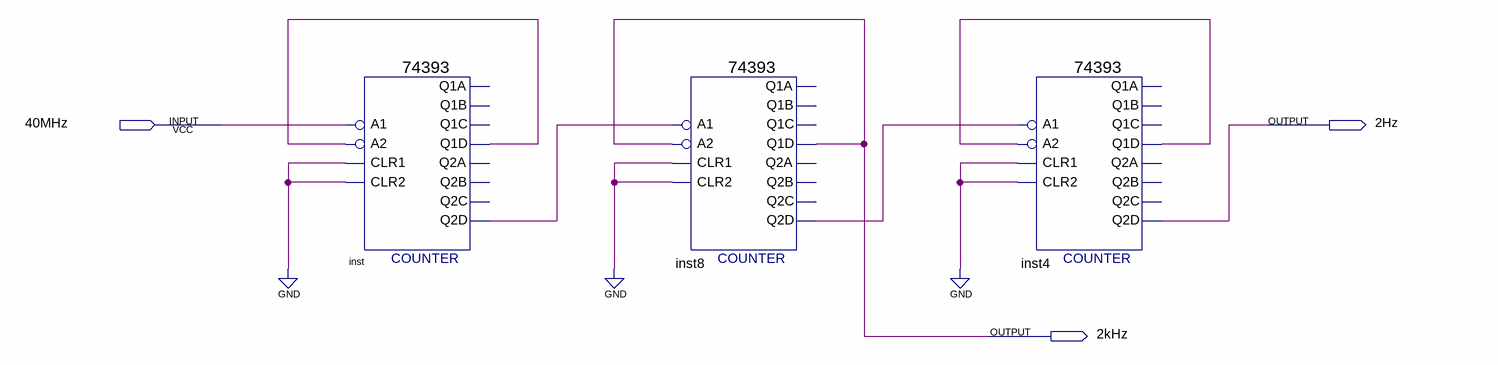
[diagram p0: schematic sheet]
// Quartus schematic 20M.bdf as structural Verilog: 3 symbols, 3 pins
module \20M  (
  input  \40MHz ,
  output \2Hz ,
  output \2kHz 
);

  wire inst4_q1d, inst8_q2d, inst_q1d, inst_q2d;

  \74393  inst (
    .A1(\40MHz ), .CLR1(1'b0), .A2(inst_q1d), .CLR2(1'b0), .Q2D(inst_q2d), .Q1D(inst_q1d));  // open: Q2C, Q2B, Q1C, Q2A, Q1A, Q1B
  \74393  inst8 (
    .A1(inst_q2d), .CLR1(1'b0), .A2(\2kHz ), .CLR2(1'b0), .Q2D(inst8_q2d), .Q1D(\2kHz ));  // open: Q2C, Q2B, Q1C, Q2A, Q1A, Q1B
  \74393  inst4 (
    .A1(inst8_q2d), .CLR1(1'b0), .A2(inst4_q1d), .CLR2(1'b0), .Q2D(\2Hz ), .Q1D(inst4_q1d));  // open: Q2C, Q2B, Q1C, Q2A, Q1A, Q1B
endmodule
